# EAGLE design MicroCo (EAGLE 8.3.2)
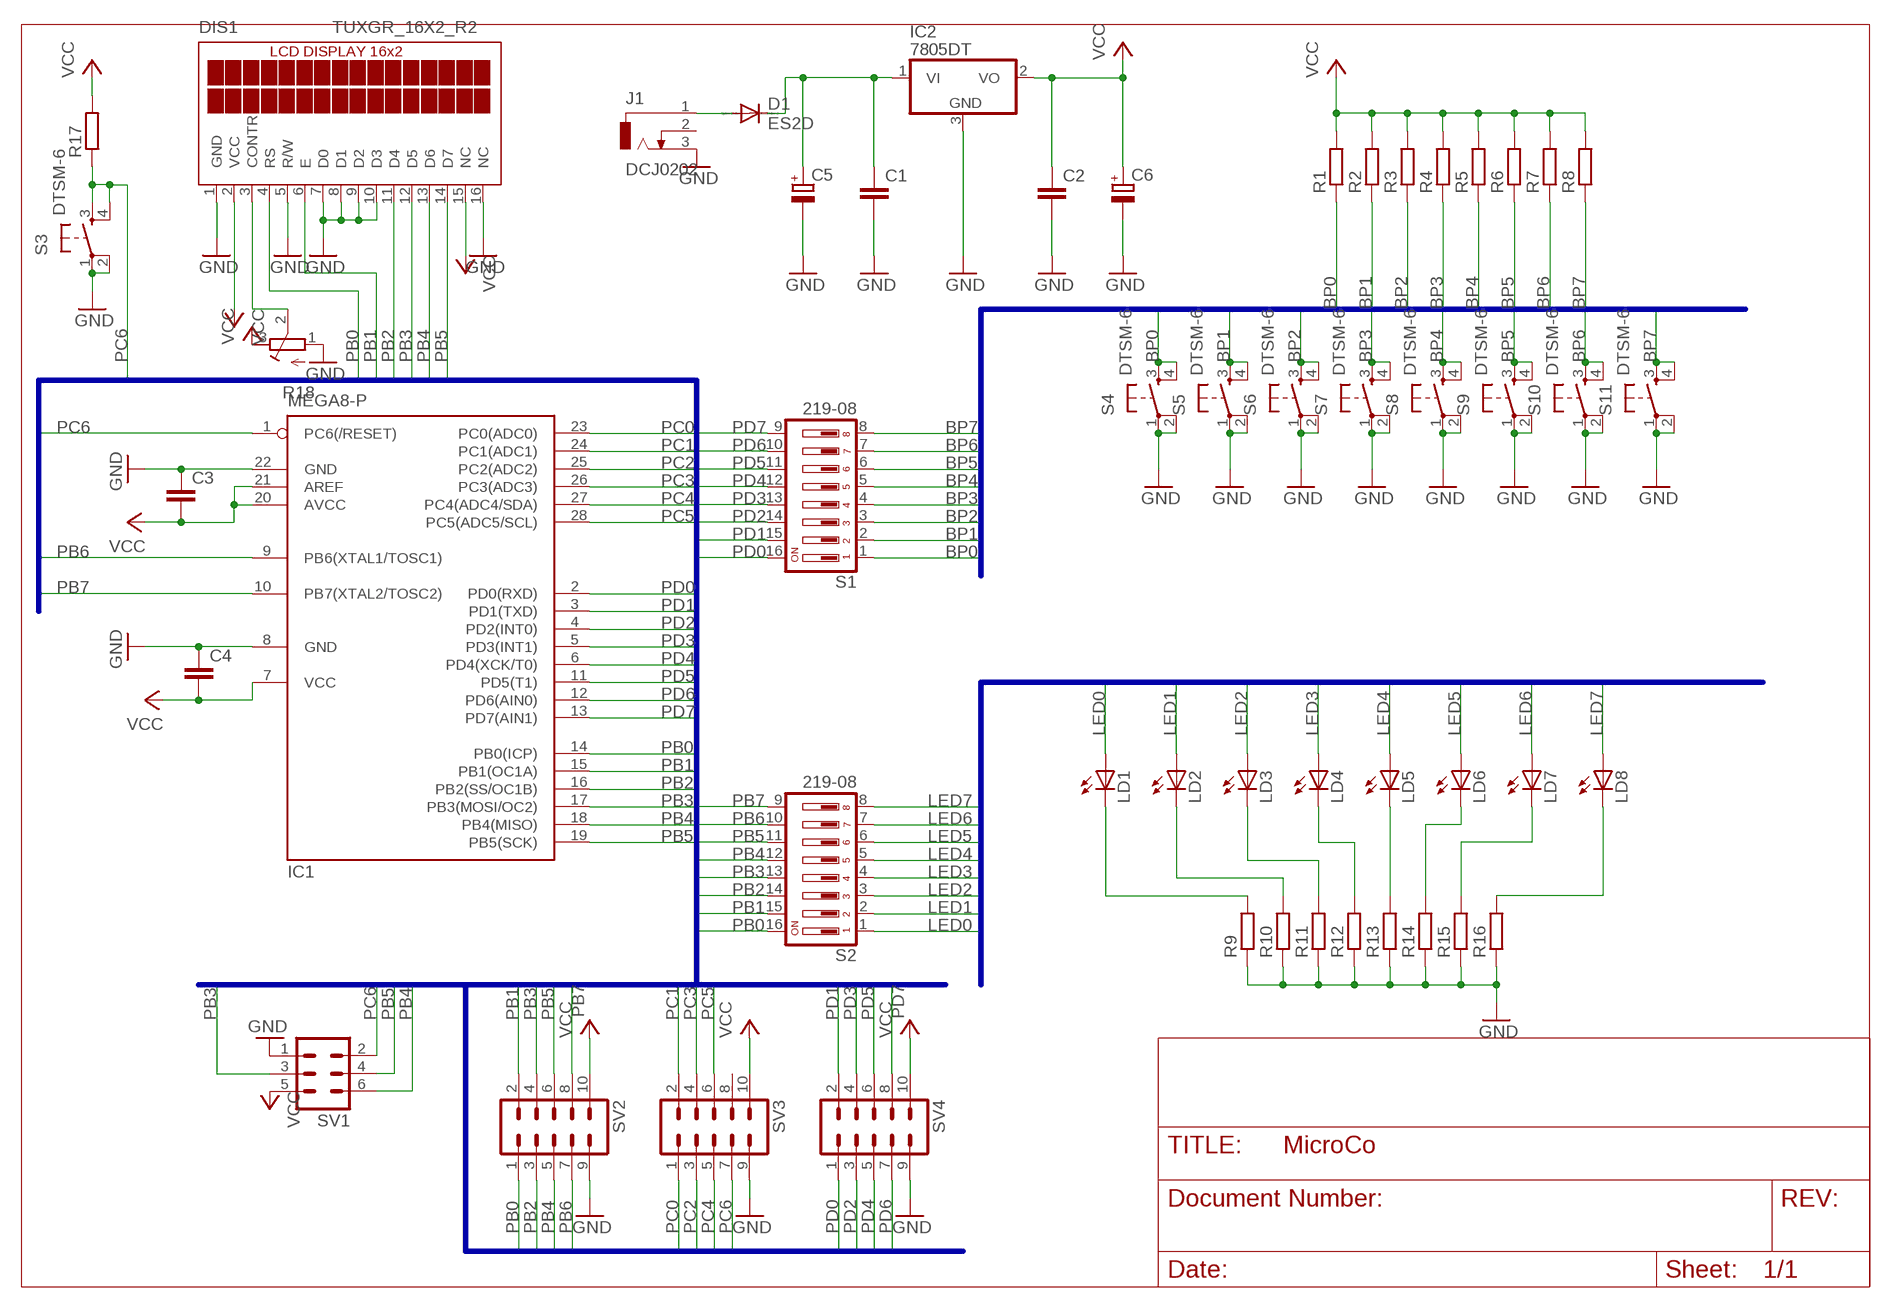
[diagram p0: schematic, sheet 1]

## Parts
C1  C-EUC1206  [C1206]
C2  C-EUC1206  [C1206]
C3  C-EUC1206  [C1206]
C4  C-EUC1206  [C1206]
C5  CPOL-EU153CLV-1010  [153CLV-1010]
C6  CPOL-EU153CLV-0605  [153CLV-0605]
D1  ES2D  [SMB]
DIS1  TUXGR_16X2_R2  [TUXGR_16X2_R2]
IC1  MEGA8-P  [DIL28-3]
IC2  7805DT  [TO252]
J1  DCJ0202  [DCJ0202]
LD1  LEDCHIPLED_1206  [CHIPLED_1206]
LD2  LEDCHIPLED_1206  [CHIPLED_1206]
LD3  LEDCHIPLED_1206  [CHIPLED_1206]
LD4  LEDCHIPLED_1206  [CHIPLED_1206]
LD5  LEDCHIPLED_1206  [CHIPLED_1206]
LD6  LEDCHIPLED_1206  [CHIPLED_1206]
LD7  LEDCHIPLED_1206  [CHIPLED_1206]
LD8  LEDCHIPLED_1206  [CHIPLED_1206]
R1  R-EU_M1206  [M1206]
R2  R-EU_M1206  [M1206]
R3  R-EU_M1206  [M1206]
R4  R-EU_M1206  [M1206]
R5  R-EU_M1206  [M1206]
R6  R-EU_M1206  [M1206]
R7  R-EU_M1206  [M1206]
R8  R-EU_M1206  [M1206]
R9  R-EU_M1206  [M1206]
R10  R-EU_M1206  [M1206]
R11  R-EU_M1206  [M1206]
R12  R-EU_M1206  [M1206]
R13  R-EU_M1206  [M1206]
R14  R-EU_M1206  [M1206]
R15  R-EU_M1206  [M1206]
R16  R-EU_M1206  [M1206]
R17  R-EU_M1206  [M1206]
R18  R-TRIMM4G/J  [RTRIM4G/J]
S1  219-08  [CTS-219-08]
S2  219-08  [CTS-219-08]
S3  DTSM-6  [DTSM-6]
S4  DTSM-6  [DTSM-6]
S5  DTSM-6  [DTSM-6]
S6  DTSM-6  [DTSM-6]
S7  DTSM-6  [DTSM-6]
S8  DTSM-6  [DTSM-6]
S9  DTSM-6  [DTSM-6]
S10  DTSM-6  [DTSM-6]
S11  DTSM-6  [DTSM-6]
SV1  ML6  [ML6]
SV2  MA05-2  [MA05-2]
SV3  MA05-2  [MA05-2]
SV4  MA05-2  [MA05-2]

## Nets
BP0: R1.1 S1.1 S4.3 S4.4
BP1: R2.1 S1.2 S5.3 S5.4
BP2: R3.1 S1.3 S6.3 S6.4
BP3: R4.1 S1.4 S7.3 S7.4
BP4: R5.1 S1.5 S8.3 S8.4
BP5: R6.1 S1.6 S9.3 S9.4
BP6: R7.1 S1.7 S10.3 S10.4
BP7: R8.1 S1.8 S11.3 S11.4
GND: C1.2 C2.2 C3.1 C4.1 C5.- C6.- DIS1.1(GND) DIS1.5(R/W) DIS1.7(D0) DIS1.8(D1) DIS1.9(D2) DIS1.10(D3) DIS1.16(NC) IC1.8(GND) IC1.22(GND) IC2.3(GND) J1.3 R9.1 R10.1 R11.1 R12.1 R13.1 R14.1 R15.1 R16.1 R18.1(A) S3.1 S3.2 S4.1 S4.2 S5.1 S5.2 S6.1 S6.2 S7.1 S7.2 S8.1 S8.2 S9.1 S9.2 S10.1 S10.2 S11.1 S11.2 SV1.1 SV2.9 SV3.9 SV4.9
LED0: LD1.A S2.1
LED1: LD2.A S2.2
LED2: LD3.A S2.3
LED3: LD4.A S2.4
LED4: LD5.A S2.5
LED5: LD6.A S2.6
LED6: LD7.A S2.7
LED7: LD8.A S2.8
N$1: DIS1.3(CONTR) R18.2(S)
N$2: D1.A J1.1
N$3: C1.1 C5.+ D1.C IC2.1(VI)
N$4: LD1.C R9.2
N$5: LD2.C R10.2
N$6: LD3.C R11.2
N$7: LD4.C R12.2
N$8: LD5.C R13.2
N$9: LD6.C R14.2
N$10: LD7.C R15.2
N$11: LD8.C R16.2
PB0: DIS1.4(RS) IC1.14(PB0(ICP)) S2.16 SV2.1
PB1: DIS1.6(E) IC1.15(PB1(OC1A)) S2.15 SV2.2
PB2: DIS1.11(D4) IC1.16(PB2(SS/OC1B)) S2.14 SV2.3
PB3: DIS1.12(D5) IC1.17(PB3(MOSI/OC2)) S2.13 SV1.3 SV2.4
PB4: DIS1.13(D6) IC1.18(PB4(MISO)) S2.12 SV1.6 SV2.5
PB5: DIS1.14(D7) IC1.19(PB5(SCK)) S2.11 SV1.4 SV2.6
PB6: IC1.9(PB6(XTAL1/TOSC1)) S2.10 SV2.7
PB7: IC1.10(PB7(XTAL2/TOSC2)) S2.9 SV2.8
PC0: IC1.23(PC0(ADC0)) SV3.1
PC1: IC1.24(PC1(ADC1)) SV3.2
PC2: IC1.25(PC2(ADC2)) SV3.3
PC3: IC1.26(PC3(ADC3)) SV3.4
PC4: IC1.27(PC4(ADC4/SDA)) SV3.5
PC5: IC1.28(PC5(ADC5/SCL)) SV3.6
PC6: IC1.1(PC6(/RESET)) R17.1 S3.3 S3.4 SV1.2 SV3.7
PD0: IC1.2(PD0(RXD)) S1.16 SV4.1
PD1: IC1.3(PD1(TXD)) S1.15 SV4.2
PD2: IC1.4(PD2(INT0)) S1.14 SV4.3
PD3: IC1.5(PD3(INT1)) S1.13 SV4.4
PD4: IC1.6(PD4(XCK/T0)) S1.12 SV4.5
PD5: IC1.11(PD5(T1)) S1.11 SV4.6
PD6: IC1.12(PD6(AIN0)) S1.10 SV4.7
PD7: IC1.13(PD7(AIN1)) S1.9 SV4.8
VCC: C2.1 C3.2 C4.2 C6.+ DIS1.2(VCC) DIS1.15(NC) IC1.7(VCC) IC1.20(AVCC) IC1.21(AREF) IC2.2(VO) R1.2 R2.2 R3.2 R4.2 R5.2 R6.2 R7.2 R8.2 R17.2 R18.3(E) SV1.5 SV2.10 SV3.10 SV4.10
Unconnected: J1.2 SV3.8

## Buses
PB[0..7],PC[0..7],PD[0..7]
BP[0..7]
LED[0..7]

## Library data of the parts
C1-C4 = rcl:C-EU: CAPACITOR, European symbol
C5 C6 = rcl:CPOL-EU: POLARIZED CAPACITOR, European symbol
D1 = diode:ES2D: DIODE super fast rectifier, 2 A
DIS1 = display-lcd:TUXGR_16X2_R2: Tuxgraphics LCD display 16x2 characters reflective, without background light Source: tuxgr_12x2_r2.pdf; OC_FARNELL: unknown; OC_NEWARK: unknown
IC1 = atmel:MEGA8-P: MICROCONTROLLER 8 Kbytes FLASH, 1 kbytes SRAM, 512 bytes EEPROM, USART, 4-channel 10 bit ADC, 2-channel 8 bit ADC Pin compatible with Atmega48, ATMega88, ATMega168 Source: avr.lbr; OC_FARNELL: unknown; OC_NEWARK: unknown
IC2 = linear:78*: Positive VOLTAGE REGULATOR Source: http://cache.national.com/ds/LM/LM78L05.pdf http://www.fairchildsemi.com/ds/LM/LM7805.pdf
J1 = con-jack:DCJ0202: DC POWER JACK Source: DCJ0202.pdf; OC_FARNELL: unknown; OC_NEWARK: unknown
LD1-LD8 = led:LED: LED OSRAM: - CHIPLED LG R971, LG N971, LY N971, LG Q971, LY Q971, LO R971, LY R971 LH N974, LH R974 LS Q976, LO Q976, LY Q976 LO Q996 - Hyper CHIPLED LW Q18S LB Q993, LB Q99A, LB R99A - SideLED LS A670, LO A670, LY A670, LG A670, LP A670 LB A673, LV A673, LT A673, LW A673 LH A674 LY A675 LS A676, LA A676, LO A676, LY A676, LW A676 LS A679, LY A679, LG A679 - Hyper Micro SIDELED® LS Y876, LA Y876, LO Y876, LY Y876 LT Y87S - SmartLED LW L88C, LW L88S LB L89C, LB L89S, LG L890 LS L89K, LO L89K, LY L89K LS L896, LA L896, LO L896, LY L896 - TOPLED LS T670, LO T670, LY T670, LG T670, LP T670 LSG T670, LSP T670, LSY T670, LOP T670, LYG T670 LG T671, LOG T671, LSG T671 LB T673, LV T673, LT T673, LW T673 LH T674 LS T676, LA T676, LO T676, LY T676, LB T676, LH T676, LSB T676, LW T676 LB T67C, LV T67C, LT T67C, LS T67K, LO T67K, LY T67K, LW E67C LS E67B, LA E67B, LO E67B, LY E67B, LB E67C, LV E67C, LT E67C LW T67C LS T679, LY T679, LG T679 LS T770, LO T770, LY T770, LG T770, LP T770 LB T773, LV T773, LT T773, LW T773 LH T774 LS E675, LA E675, LY E675, LS T675 LS T776, LA T776, LO T776, LY T776, LB T776 LHGB T686 LT T68C, LB T68C - Hyper Mini TOPLED® LB M676 - Mini TOPLED Santana® LG M470 LS M47K, LO M47K, LY M47K Source: http://www.osram.convergy.de/
R1-R17 = rcl:R-EU_: RESISTOR, European symbol
R18 = rcl:R-TRIMM: Trimm resistor
S1 S2 = switch-dil:219-08*: Surface Mount DIP Switch Series 219 SMT CTS Electronic Components Sourc: www.ctscorp.com; OC_FARNELL: unknown; OC_NEWARK: unknown
S3-S11 = switch-tact:DTSM-6
SV1 = con-ml:ML6: HARTING; OC_FARNELL: unknown; OC_NEWARK: unknown
SV2-SV4 = con-lstb:MA05-2: PIN HEADER; OC_FARNELL: unknown; OC_NEWARK: unknown

## Board
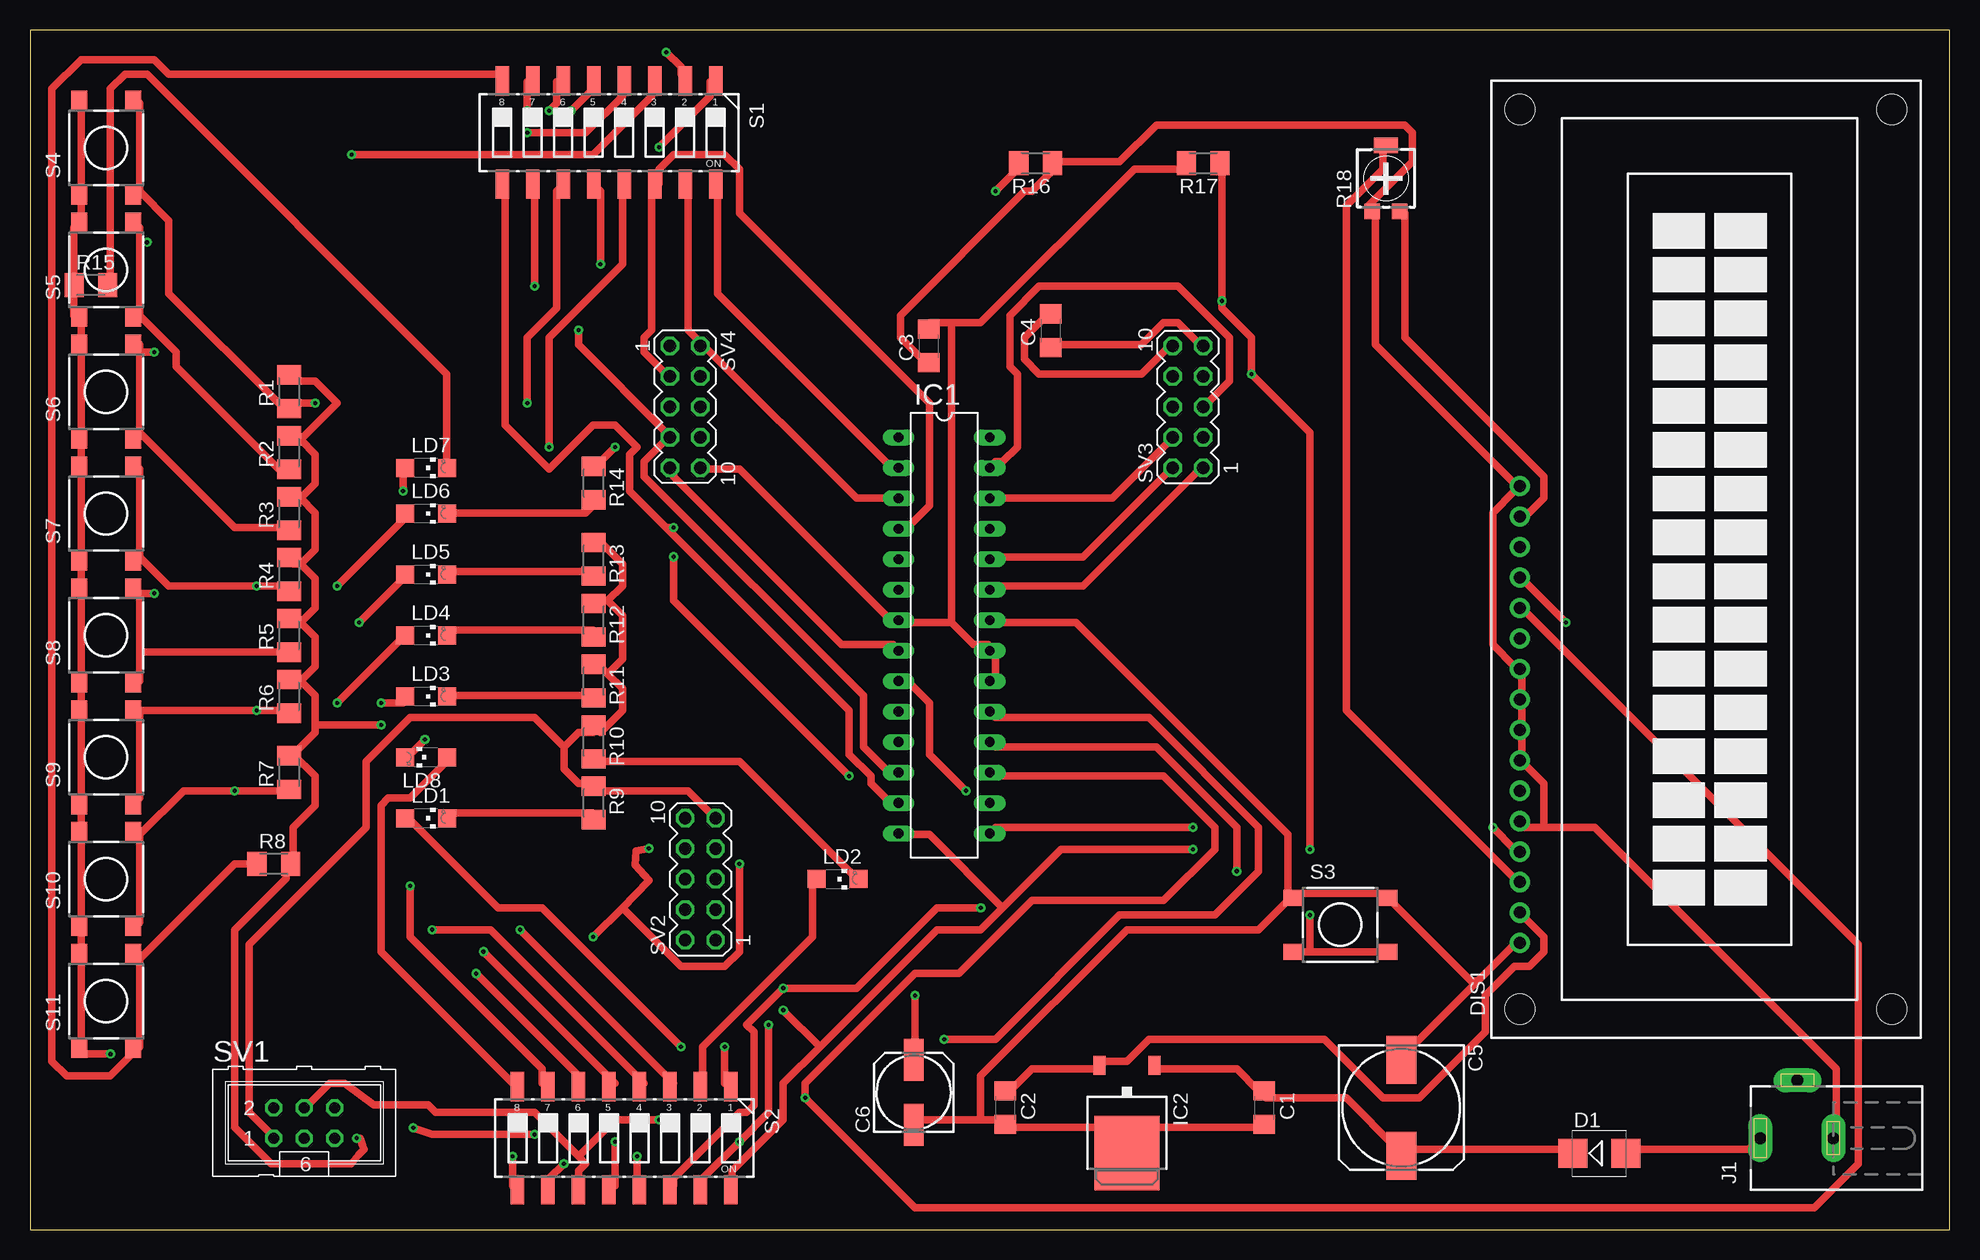
[diagram p1: board, top side]
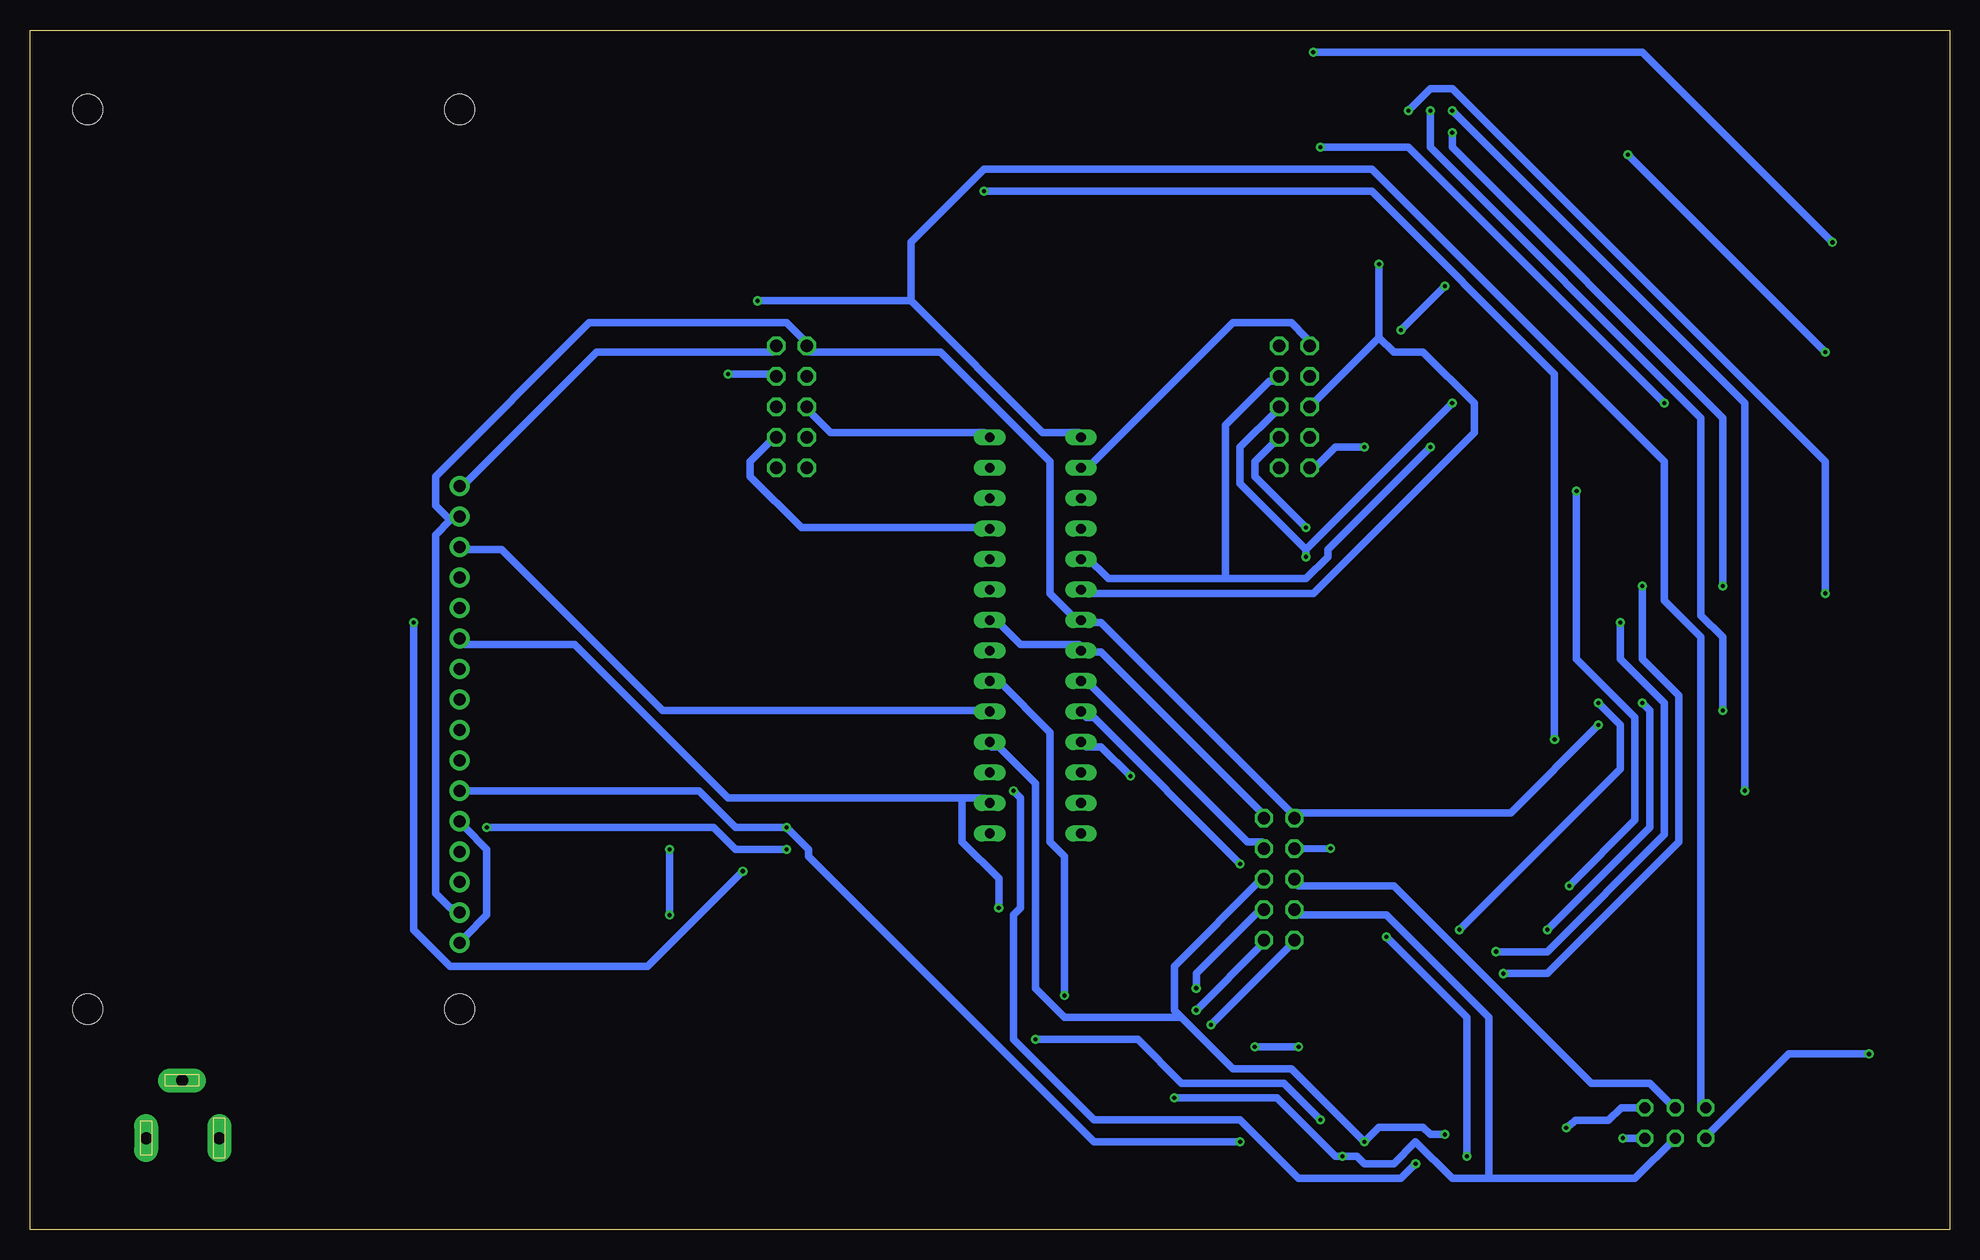
[diagram p2: board, bottom side, seen from below]

Size 160 x 100 mm. Coordinates in mm from the lower left corner, seen from the top.
Outline: 0,0 160,0 160,100 0,100 0,0
Copper layers (1*16): Top 0.035mm / dielectric 1.5mm / Bottom 0.035mm
Design rules "default *": minimum track width 24mil, minimum drill 0.35mm, track to track 24mil, track to pad 24mil, pad to pad 24mil, via to via 24mil, smd to smd 24mil, copper to edge 40mil, drill to drill 6mil, minimum pad ring 10mil, minimum via ring 8mil, stop-mask expansion 4mil, vias tented up to drill 0mil, thermal gap 10mil

### Footprints (pad centres in the part's own frame; a part is rotated, then mirrored left to right if it is on the bottom)
C1206 = smd 1.6 x 1.8: 1 -1.4,0; 2 1.4,0
153CLV-1010 = smd 4 x 2.5: + 4,0; - -4,0
153CLV-0605 = smd 3.5 x 1.6: + 2.7,0; - -2.7,0
SMB = smd 2.4 x 2.4: A 2.2,0; C -2.2,0
TUXGR_16X2_R2 = drill 1 pad 1.676: 1 -32,15.5; 2 -29.46,15.5; 3 -26.92,15.5; 4 -24.38,15.5; 5 -21.84,15.5; 6 -19.3,15.5; 7 -16.76,15.5; 8 -14.22,15.5; 9 -11.68,15.5; 10 -9.14,15.5; 11 -6.6,15.5; 12 -4.06,15.5; 13 -1.52,15.5; 14 1.02,15.5; 15 3.56,15.5; 16 6.1,15.5 | hole 2.5: -37.5,-15.5; 37.5,-15.5; -37.5,15.5; 37.5,15.5
DIL28-3 = drill 0.813 long: 1 -16.51,-3.81; 2 -13.97,-3.81; 3 -11.43,-3.81; 4 -8.89,-3.81; 5 -6.35,-3.81; 6 -3.81,-3.81; 7 -1.27,-3.81; 8 1.27,-3.81; 9 3.81,-3.81; 10 6.35,-3.81; 11 8.89,-3.81; 12 11.43,-3.81; 13 13.97,-3.81; 14 16.51,-3.81; 15 16.51,3.81; 16 13.97,3.81; 17 11.43,3.81; 18 8.89,3.81; 19 6.35,3.81; 20 3.81,3.81; 21 1.27,3.81; 22 -1.27,3.81; 23 -3.81,3.81; 24 -6.35,3.81; 25 -8.89,3.81; 26 -11.43,3.81; 27 -13.97,3.81; 28 -16.51,3.81
TO252 = smd 1 x 1.6: 1 -2.28,-4.8; 2 2.28,-4.8 | smd 5.4 x 6.2: 3 0,2.5
DCJ0202 = drill 1 pad 2 long: 1 0,3.1; 2 4.8,0; 3 0,-3
CHIPLED_1206 = smd 1.5 x 1.5: A 0,-1.75; C 0,1.75
M1206 = smd 1.6 x 2: 1 -1.4,0; 2 1.4,0
RTRIM4G/J = smd 1.3 x 1.3: 1 -1.15,-2.75; 3 1.15,-2.75 | smd 2 x 1.3: 2 0,2.75
CTS-219-08 = smd 1.13 x 2.44: 1 -8.89,-4.3; 2 -6.35,-4.3; 3 -3.81,-4.3; 4 -1.27,-4.3; 5 1.27,-4.3; 6 3.81,-4.3; 7 6.35,-4.3; 8 8.89,-4.3; 9 8.89,4.3; 10 6.35,4.3; 11 3.81,4.3; 12 1.27,4.3; 13 -1.27,4.3; 14 -3.81,4.3; 15 -6.35,4.3; 16 -8.89,4.3
DTSM-6 = smd 1.55 x 1.3: 1 -3.975,2.25; 2 3.975,2.25; 3 -3.975,-2.25; 4 3.975,-2.25
ML6 = drill 0.914 octagon: 1 -2.54,-1.27; 2 -2.54,1.27; 3 0,-1.27; 4 0,1.27; 5 2.54,-1.27; 6 2.54,1.27
MA05-2 = drill 1.016 octagon: 1 -5.08,-1.27; 2 -5.08,1.27; 3 -2.54,-1.27; 4 -2.54,1.27; 5 0,-1.27; 6 0,1.27; 7 2.54,-1.27; 8 2.54,1.27; 9 5.08,-1.27; 10 5.08,1.27

### Placement (x,y rotation side)
C1  102.87,10.16 270 top
C2  81.28,10.16 270 top
C3  74.93,73.66 90 top
C4  85.09,74.93 90 top
C5  114.3,10.16 270 top
C6  73.66,11.43 90 top
D1  130.81,6.35 0 top
DIS1  139.7,55.88 90 top
IC1  76.2,49.53 270 top
IC2  91.44,8.89 180 top
J1  147.32,7.62 90 top
LD1  33.02,34.29 270 top
LD2  67.31,29.21 270 top
LD3  33.02,44.45 270 top
LD4  33.02,49.53 270 top
LD5  33.02,54.61 270 top
LD6  33.02,59.69 270 top
LD7  33.02,63.5 270 top
LD8  33.02,39.37 90 top
R1  21.59,69.85 90 top
R2  21.59,64.77 90 top
R3  21.59,59.69 90 top
R4  21.59,54.61 90 top
R5  21.59,49.53 90 top
R6  21.59,44.45 90 top
R7  21.59,38.1 90 top
R8  20.32,30.48 0 top
R9  46.99,35.56 270 top
R10  46.99,40.64 270 top
R11  46.99,45.72 270 top
R12  46.99,50.8 270 top
R13  46.99,55.88 270 top
R14  46.99,62.23 270 top
R15  5.08,78.74 0 top
R16  83.82,88.9 180 top
R17  97.79,88.9 180 top
R18  113.03,87.63 0 top
S1  48.26,91.44 180 top
S2  49.53,7.62 180 top
S3  109.22,25.4 0 top
S4  6.35,90.17 90 top
S5  6.35,80.01 90 top
S6  6.35,69.85 90 top
S7  6.35,59.69 90 top
S8  6.35,49.53 90 top
S9  6.35,39.37 90 top
S10  6.35,29.21 90 top
S11  6.35,19.05 90 top
SV1  22.86,8.89 0 top
SV2  55.88,29.21 90 top
SV3  96.52,68.58 90 top
SV4  54.61,68.58 270 top

### Tracks (layer width: path | path; a pad name or v marks a point on that pad's centre or on a via)
BP0  (via drill 0.35)
  Top 0.61: 9.14,86.56 9.14,93.88 S4.4 | 9.14,86.56 11.58,84.12 11.58,78.03 20.73,68.89 21.34,68.89 R1.1 21.95,68.89 v23.77,68.89 | 9.14,86.56 S4.3 | v52.43,90.22 56.69,94.49 56.69,95.71 S1.1
  Bottom 0.61: v52.43,90.22 45.11,90.22 v23.77,68.89
BP1  (via drill 0.35)
  Top 0.61: 9.14,82.3 9.14,83.52 S5.4 | 9.14,82.3 9.14,76.2 | 9.14,76.2 12.19,73.15 12.19,71.93 20.73,63.4 21.34,63.4 R2.1 | 9.14,76.2 S5.3 | v53.03,98.15 54.25,96.93 54.25,96.32 S1.2 | 9.14,82.3 v9.75,82.3
  Bottom 0.61: v53.03,98.15 25.6,98.15 v9.75,82.3
BP2  (via drill 0.35)
  Top 0.61: 9.14,73.15 9.14,73.76 S6.4 9.14,73.15 | 9.14,73.15 9.14,66.45 | 9.14,66.45 17.07,58.52 21.34,58.52 R3.1 | 9.14,66.45 S6.3 | v26.82,89.61 46.94,89.61 51.82,94.49 51.82,95.71 S1.3 | 9.14,73.15 v10.36,73.15
  Bottom 0.61: v10.36,73.15 v26.82,89.61
BP3  (via drill 0.35)
  Top 0.61: 9.14,56.08 9.14,63.4 S7.4 | 9.14,56.08 11.58,53.65 v18.9,53.65 21.34,53.65 R4.1 | 9.14,56.08 S7.3 | v41.45,91.44 46.33,91.44 49.38,94.49 49.38,95.71 S1.4
  Bottom 0.61: v41.45,91.44 41.45,90.22 18.9,67.67 v18.9,53.65
BP4  (via drill 0.35)
  Top 0.61: 9.14,53.03 9.14,48.16 | 9.14,48.16 9.14,45.72 S8.3 | 9.14,48.16 21.34,48.16 R5.1 | v45.11,93.27 46.94,95.1 46.94,95.71 S1.5 | 9.14,53.03 v10.36,53.03 | 9.14,53.03 S8.4
  Bottom 0.61: v45.11,93.27 43.28,95.1 41.45,95.1 10.36,64.01 v10.36,53.03
BP5  (via drill 0.35)
  Top 0.61: 9.14,43.28 9.14,35.97 S9.3 | 9.14,43.28 v18.9,43.28 21.34,43.28 R6.1 | 9.14,43.28 S9.4 | v43.28,93.27 43.89,93.88 43.89,95.71 S1.6
  Bottom 0.61: v43.28,93.27 43.28,90.22 20.73,67.67 20.73,51.21 18.9,49.38 v18.9,43.28
BP6  (via drill 0.35)
  Top 0.61: 9.14,32.92 9.14,25.6 S10.3 | 9.14,32.92 12.8,36.58 v17.07,36.58 21.34,36.58 R7.1 | 9.14,32.92 S10.4 | v41.45,93.27 41.45,95.71 S1.7
  Bottom 0.61: v41.45,93.27 17.07,68.89 v17.07,36.58
BP7
  Top 0.61: 9.14,22.55 9.14,15.24 S11.3 8.53,14.63 6.71,12.8 3.05,12.8 1.83,14.02 1.83,95.1 4.27,97.54 10.36,97.54 11.58,96.32 39.01,96.32 S1.8 | R8.1 17.07,30.48 9.14,22.55 | 9.14,22.55 S11.4
GND  (via drill 0.35)
  Top 0.61: S4.2 4.27,93.88 4.27,86.56 S4.1 4.27,85.95 4.27,84.12 S5.2 3.66,83.52 3.66,79.25 R15.1 3.66,78.64 3.66,76.2 S5.1 4.27,75.59 4.27,74.37 S6.2 4.27,73.76 4.27,66.45 S6.1 4.27,65.84 4.27,64.01 S7.2 4.27,63.4 4.27,56.08 S7.1 4.27,55.47 4.27,53.65 S8.2 4.27,53.03 4.27,45.72 S8.1 4.27,45.11 4.27,43.89 S9.2 4.27,43.28 4.27,35.97 S9.1 4.27,35.36 4.27,33.53 S10.2 4.27,32.92 4.27,25.6 S10.1 4.27,24.99 4.27,23.16 S11.2 4.27,22.55 4.27,15.24 S11.1 4.27,14.63 v6.71,14.63 | v48.77,65.23 47.55,64.01 R14.1 | SV4.9 53.65,63.4 53.65,62.79 67.67,48.77 71.93,48.77 IC1.8 | 48.16,52.43 47.55,52.43 R12.1 | 48.16,52.43 49.38,53.65 49.38,55.47 47.55,57.3 R13.1 | 44.5,40.23 44.5,38.41 45.72,37.19 46.94,37.19 R9.1 47.55,36.58 54.86,36.58 SV2.9 | 44.5,40.23 45.72,41.45 46.94,41.45 R10.1 47.55,41.45 49.38,43.28 49.38,45.11 48.16,46.33 | 48.16,46.33 47.55,46.94 R11.1 | 44.5,40.23 42.06,42.67 31.7,42.67 28.04,39.01 28.04,33.53 18.29,23.77 18.29,9.75 20.12,7.92 SV1.1 | 48.16,52.43 49.38,51.21 49.38,47.55 48.16,46.33 | C3.1 74.37,72.54 72.54,74.37 72.54,76.2 82.91,86.56 83.52,86.56 85.34,88.39 R16.1 85.34,89 90.83,89 93.88,92.05 114.61,92.05 115.21,91.44 115.21,89 111.56,85.34 R18.1 112.17,84.73 112.17,73.76 123.75,62.18 DIS1.16 123.75,61.57 121.92,59.74 121.92,48.77 123.75,46.94 DIS1.10 124.36,46.33 124.36,44.5 DIS1.9 124.36,43.89 124.36,42.06 DIS1.8 124.36,41.45 124.36,39.62 DIS1.7 124.36,39.01 126.19,37.19 126.19,33.53 | C4.1 85.34,73.76 92.66,73.76 94.49,75.59 95.71,75.59 97.54,73.76 SV3.9 | 79.25,9.14 73.76,9.14 C6.- | 79.25,9.14 81.08,9.14 C2.2 81.69,8.53 89.61,8.53 91.44,6.71
  Top 0.61: 91.44,6.71 93.27,8.53 102.41,8.53 C1.2 | 91.44,6.71 IC2.3 | S3.1 105.46,28.04 112.78,28.04 S3.2 113.39,27.43 120.09,20.73 120.7,20.73 | 120.7,20.73 123.75,23.77 DIS1.1 | 120.7,20.73 114.61,14.63 C5.- | 126.19,33.53 124.36,33.53 DIS1.5 | 126.19,33.53 130.45,33.53 150.57,13.41 150.57,7.92 J1.3 | 79.25,9.14 79.25,12.8 91.44,24.99 102.41,24.99 104.85,27.43 S3.1 | IC1.22 80.47,50.6 87.17,50.6 104.85,32.92 104.85,28.04 S3.1
  Bottom 0.61: v48.77,65.23 51.21,65.23 53.03,63.4 SV4.9 | IC1.22 79.86,51.21 77.42,48.77 72.54,48.77 IC1.8 71.93,48.16 70.71,48.16 57.3,34.75 SV2.9 | v6.71,14.63 13.41,14.63 20.12,7.92 SV1.1 | SV3.9 98.15,73.15 112.78,73.15 123.75,62.18 DIS1.16 | DIS1.1 123.75,24.38 121.92,26.21 121.92,31.7 123.75,33.53 DIS1.5
LED0  (via drill 0.35)
  Top 0.61: v54.25,15.24 42.67,26.82 39.01,26.82 31.7,34.14 LD1.A | v57.91,15.24 57.91,12.19 S2.1
  Bottom 0.61: v57.91,15.24 v54.25,15.24
LED1
  Top 0.61: LD2.A 65.23,28.65 65.23,24.38 56.08,15.24 56.08,12.19 S2.2
LED2  (via drill 0.35)
  Top 0.61: v29.26,43.89 31.09,43.89 LD3.A | v40.84,24.99 53.65,12.19 S2.3
  Bottom 0.61: v29.26,43.89 27.43,42.06 27.43,38.41 v40.84,24.99
LED3  (via drill 0.35)
  Top 0.61: v25.6,43.89 31.09,49.38 LD4.A | v33.53,24.99 38.41,24.99 51.21,12.19 S2.4
  Bottom 0.61: v25.6,43.89 24.99,43.28 24.99,33.53 v33.53,24.99
LED4  (via drill 0.35)
  Top 0.61: v27.43,50.6 31.09,54.25 LD5.A | v37.8,23.16 48.77,12.19 S2.5
  Bottom 0.61: v27.43,50.6 27.43,47.55 23.77,43.89 23.77,32.92 33.53,23.16 v37.8,23.16
LED5  (via drill 0.35)
  Top 0.61: v25.6,53.65 31.09,59.13 LD6.A | v37.19,21.34 45.72,12.8 S2.6
  Bottom 0.61: v25.6,53.65 25.6,47.55 22.55,44.5 22.55,32.31 33.53,21.34 v37.19,21.34
LED6  (via drill 0.35)
  Top 0.61: v31.09,61.57 31.09,63.4 LD7.A | v31.7,28.65 31.7,24.38 42.67,13.41 42.67,12.19 S2.7
  Bottom 0.61: v31.09,61.57 31.09,47.55 26.21,42.67 26.21,34.14 v31.7,28.65
LED7
  Top 0.61: LD8.A 34.75,39.01 31.7,35.97 29.87,35.97 29.26,35.36 29.26,23.16 40.23,12.19 S2.8
N$1
  Top 0.61: R18.2 112.78,90.22 112.78,88.39 109.73,85.34 109.73,43.28 123.75,29.26 DIS1.3
N$2
  Top 0.61: D1.A 133.5,6.71 143.26,6.71 143.87,7.32 J1.1
N$3
  Top 0.61: IC2.1 93.88,13.41 100.58,13.41 102.41,11.58 C1.1 103.02,10.97 109.73,10.97 114,6.71 C5.+ 114.61,6.71 128.02,6.71 D1.C
N$4
  Top 0.61: LD1.C 35.36,34.75 46.94,34.75 R9.2
N$5
  Top 0.61: LD2.C 68.89,29.26 59.13,39.01 47.55,39.01 R10.2
N$6
  Top 0.61: LD3.C 35.36,44.5 46.94,44.5 R11.2
N$7
  Top 0.61: LD4.C 35.36,49.99 46.94,49.99 R12.2
N$8
  Top 0.61: LD5.C 35.36,54.86 46.94,54.86 R13.2
N$9
  Top 0.61: LD6.C 35.36,59.74 46.33,59.74 46.94,60.35 R14.2
N$10
  Top 0.61: LD7.C 34.75,64.01 34.75,71.32 9.75,96.32 7.92,96.32 6.71,95.1 6.71,79.25 R15.2
N$11  (via drill 0.35)
  Top 0.61: v32.92,40.84 31.7,39.62 LD8.C | v80.47,86.56 82.3,88.39 R16.2
  Bottom 0.61: v32.92,40.84 32.92,71.32 48.16,86.56 v80.47,86.56
PB0  (via drill 0.35)
  Top 0.61: 65.84,15.24 75.59,24.99 79.25,24.99 81.08,26.82 | 65.84,15.24 62.79,12.19 62.79,9.14 58.52,4.88 58.52,3.66 S2.16 | 81.08,26.82 74.98,32.92 72.54,32.92 IC1.14 | 65.84,15.24 v62.79,18.29 | v121.92,33.53 123.75,31.7 DIS1.4 | v96.93,31.7 85.95,31.7 81.08,26.82
  Bottom 0.61: v62.79,18.29 57.3,23.77 SV2.1 | v121.92,33.53 103.02,33.53 101.19,31.7 v96.93,31.7
PB1  (via drill 0.35)
  Top 0.61: v61.57,17.07 61.57,9.75 v59.13,7.32 56.08,4.27 56.08,3.66 S2.15 | v96.93,33.53 80.47,33.53 IC1.15
  Bottom 0.61: v61.57,17.07 54.86,23.77 SV2.2 | DIS1.6 123.75,36.58 104.24,36.58 101.19,33.53 v96.93,33.53 95.1,31.7 95.1,31.09 71.32,7.32 v59.13,7.32
PB2  (via drill 0.35)
  Top 0.61: S2.14 53.65,3.66 53.65,4.27 59.13,9.75 59.74,9.75 60.35,10.36 60.35,16.46 59.74,17.07 v62.79,20.12 68.89,20.12 75.59,26.82 v79.25,26.82
  Bottom 0.61: v62.79,20.12 62.79,21.34 57.3,26.82 SV2.3 | 82.3,35.97 101.8,35.97 114.61,48.77 123.75,48.77 DIS1.11 | 82.3,35.97 80.47,35.97 IC1.16 | v79.25,26.82 79.25,29.26 82.3,32.31 82.3,35.97
PB3  (via drill 0.35)
  Top 0.61: v50.6,6.1 50.6,3.66 S2.13 | IC1.17 80.47,37.8 94.49,37.8 98.75,33.53 98.75,31.7 94.49,27.43 83.52,27.43 77.42,21.34 73.76,21.34 64.62,12.19 v64.62,10.97 73.76,1.83 148.74,1.83 152.4,5.49 152.4,23.77 124.36,51.82 DIS1.12
  Bottom 0.61: 38.41,4.27 26.21,4.27 SV1.3 | 38.41,4.27 41.45,4.27 44.5,7.32 46.33,5.49 48.77,5.49 49.38,6.1 v50.6,6.1 51.21,6.1 56.08,10.97 v64.62,10.97 | 38.41,4.27 38.41,17.68 46.94,26.21 54.25,26.21 SV2.4
PB4  (via drill 0.35)
  Top 0.61: v48.77,7.32 48.77,3.66 S2.12 | v31.95,8.48 31.9,8.48 33.53,7.92 v42.06,7.92 | v128.02,50.6 124.36,54.25 DIS1.13 | v100.58,29.87 100.58,33.53 93.88,40.23 80.47,40.23 IC1.18
  Bottom 0.61: 64.01,17.68 64.62,18.29 64.62,21.95 57.3,29.26 SV2.5 | 64.01,17.68 59.74,13.41 54.86,13.41 v48.77,7.32 47.55,8.53 43.89,8.53 43.28,7.92 v42.06,7.92 | 64.01,17.68 73.76,17.68 76.2,20.12 76.2,37.19 79.25,40.23 79.86,40.23 IC1.18 | v31.95,8.48 31.34,8.94 31.19,9.09 28.42,9.09 27.36,10.16 SV1.6 | v128.02,50.6 128.02,24.99 124.97,21.95 108.51,21.95 v100.58,29.87
PB5  (via drill 0.35)
  Top 0.61: S2.11 45.72,4.88 46.33,5.49 45.72,6.1 | 45.72,6.1 42.06,9.75 33.81,9.78 33.17,10.41 28.65,10.41 26.21,12.19 24.99,12.19 23.16,10.36 SV1.4 | 45.72,6.1 48.77,9.14 v52.43,9.14 | v76.2,15.85 80.47,15.85 90.83,26.21 98.75,26.21 102.41,29.87 102.41,33.53 93.27,42.67 80.47,42.67 IC1.19
  Bottom 0.61: SV2.6 54.25,28.65 46.33,28.65 29.87,12.19 24.99,12.19 23.16,10.36 SV1.4 | IC1.19 80.47,43.28 107.29,43.28 120.7,56.69 123.75,56.69 DIS1.14 | v52.43,9.14 55.47,12.19 64.01,12.19 67.67,15.85 v76.2,15.85
PB6  (via drill 0.35)
  Top 0.61: v44.5,5.49 43.28,4.27 43.28,3.66 S2.10 | v78.03,36.58 74.98,39.62 74.98,43.89 73.15,45.72 IC1.9
  Bottom 0.61: v44.5,5.49 45.72,4.27 54.25,4.27 59.13,9.14 71.32,9.14 78.03,15.85 78.03,26.21 77.42,26.82 77.42,35.97 v78.03,36.58 | SV2.7 57.3,32.31 58.52,32.31 71.93,45.72 IC1.9
PB7  (via drill 0.35)
  Top 0.61: v40.23,6.1 40.23,3.66 S2.9 | v51.59,31.77 50.52,31.55 50.44,30.38 51.59,29.11 51.56,29.06 49.38,26.82 | 49.38,26.82 v46.94,24.38 | v59.13,30.48 59.13,23.16 57.91,21.95 54.25,21.95 49.38,26.82
  Bottom 0.61: v40.23,6.1 40.23,17.68 v46.94,24.38 | v51.59,31.77 SV2.8 | v59.13,30.48 71.32,42.67 71.93,42.67 IC1.10
PC0
  Top 0.61: IC1.23 80.47,53.65 87.78,53.65 97.54,63.4 SV3.1
PC1
  Top 0.61: IC1.24 80.47,56.08 87.78,56.08 95.1,63.4 SV3.2
PC2
  Bottom 0.61: IC1.25 80.47,58.52 95.71,58.52 99.97,62.79 99.97,64.01 98.15,65.84 SV3.3
PC3
  Top 0.61: IC1.26 90.22,60.96 95.1,65.84 SV3.4
PC4
  Top 0.61: IC1.27 80.47,64.01 81.08,64.01 82.3,65.23 82.3,71.32 81.69,71.93 81.69,76.2 84.12,78.64 95.71,78.64 99.97,74.37 99.97,70.71 98.15,68.89 SV3.5
PC5
  Bottom 0.61: IC1.28 80.47,66.45 93.27,66.45 95.1,68.28 SV3.6
PC6  (via drill 0.35)
  Top 0.61: 106.68,23.16 112.78,23.16 S3.4 | 106.68,23.16 105.46,23.16 S3.3 | R17.1 99.36,88.39 v99.36,77.42 99.36,76.81 101.8,74.37 v101.8,71.32 106.68,66.45 v106.68,31.7 | v106.68,26.21 106.68,23.16
  Bottom 0.61: v101.8,71.32 98.15,71.32 SV3.7 | 86.56,77.42 75.59,66.45 72.54,66.45 IC1.1 | v99.36,77.42 86.56,77.42 | 86.56,77.42 86.56,82.3 80.47,88.39 48.16,88.39 23.77,64.01 23.77,52.43 20.73,49.38 20.73,10.36 SV1.2 | v106.68,31.7 v106.68,26.21
PD0
  Top 0.61: S1.16 57.3,86.56 57.3,78.03 71.93,63.4 IC1.2
  Bottom 0.61: SV4.1 53.65,73.76 53.65,74.37 54.86,75.59 59.74,75.59 71.93,63.4 IC1.2
PD1
  Top 0.61: 56.08,73.76 54.86,74.98 54.86,86.56 S1.15 | IC1.3 68.89,60.96 56.08,73.76 | 56.08,73.76 SV4.2
PD2
  Top 0.61: SV4.3 53.03,71.32 51.21,73.15 51.21,74.37 51.82,74.98 51.82,86.56 S1.14 52.43,87.17 52.43,88.39 53.65,89.61 57.91,89.61 59.13,88.39 59.13,84.73 74.98,68.89 74.98,60.35 73.15,58.52 72.54,58.52 IC1.4
PD3  (via drill 0.35)
  Top 0.61: v43.28,65.23 43.28,74.37 49.38,80.47 49.38,86.56 S1.13
  Bottom 0.61: v43.28,65.23 51.82,56.69 51.82,56.08 53.65,54.25 60.35,54.25 | 60.35,54.25 70.1,54.25 71.93,56.08 IC1.5 | 60.35,54.25 60.35,67.06 56.69,70.71 56.08,70.71 SV4.4
PD4  (via drill 0.35)
  Top 0.61: v47.55,80.47 47.55,86.56 S1.12
  Bottom 0.61: 47.55,74.37 v47.55,80.47 | SV4.5 47.55,74.37 | 47.55,74.37 46.33,73.15 43.89,73.15 39.62,68.89 39.62,66.45 53.03,53.03 71.93,53.03 IC1.6
PD5  (via drill 0.35)
  Top 0.61: v41.45,68.89 41.45,74.37 43.89,76.81 43.89,86.56 S1.11 | v68.28,37.8 53.65,52.43 v53.65,56.08
  Bottom 0.61: 53.65,56.69 v41.45,68.89 | 53.65,56.69 59.13,62.18 59.13,65.23 56.08,68.28 SV4.6 | v68.28,37.8 70.71,40.23 71.93,40.23 IC1.11 | 53.65,56.69 v53.65,56.08
PD6  (via drill 0.35)
  Top 0.61: v42.06,78.64 42.06,86.56 S1.10 | v45.72,74.98 45.72,73.76 53.03,66.45 SV4.7 53.03,65.84 51.21,64.01 51.21,62.79 69.49,44.5 69.49,40.23 71.32,38.41 71.93,38.41 IC1.12
  Bottom 0.61: v45.72,74.98 v42.06,78.64
PD7  (via drill 0.35)
  Top 0.61: 53.03,58.52 68.28,43.28 68.28,39.62 70.1,37.8 70.1,37.19 71.93,35.36 IC1.13 | 53.03,58.52 49.99,61.57 49.99,64.62 50.6,65.23 48.77,67.06 46.94,67.06 43.28,63.4 39.62,67.06 39.62,86.56 S1.9 | 53.03,58.52 v53.65,58.52
  Bottom 0.61: SV4.8 57.91,64.01 57.91,62.79 v53.65,58.52
VCC  (via drill 0.35)
  Top 0.61: C2.1 81.69,11.58 83.52,13.41 89,13.41 IC2.2 89.61,14.02 91.44,14.02 93.27,15.85 107.9,15.85 112.78,10.97 115.82,10.97 121.31,16.46 121.31,19.51 123.75,21.95 124.97,21.95 126.19,23.16 126.19,24.38 124.36,26.21 DIS1.2 | R18.3 114.61,84.73 114.61,74.37 126.19,62.79 126.19,60.96 124.36,59.13 DIS1.15 | 21.95,39.62 23.77,41.45 23.77,42.06 | 23.77,42.06 23.77,44.5 22.55,45.72 | 22.55,45.72 21.95,46.33 R6.2 22.55,45.72 | 22.55,50.6 21.95,50.6 R5.2 22.55,50.6 | 22.55,50.6 23.77,49.38 23.77,46.94 22.55,45.72 | 22.55,55.47 21.95,55.47 R4.2 22.55,55.47 | 22.55,55.47 23.77,54.25 23.77,51.82 22.55,50.6 | 22.55,60.96 21.95,60.96 R3.2 22.55,60.96 | 22.55,60.96 23.77,59.74 23.77,56.69 22.55,55.47 | 22.55,65.84 21.95,65.84 R2.2 22.55,65.84 | 22.55,65.84 23.77,64.62 23.77,62.18 22.55,60.96 | 22.55,65.84 25.6,68.89 23.77,70.71 21.95,70.71 R1.2 | 21.95,39.62 23.77,37.8 23.77,35.36 21.95,33.53 21.95,30.48 R8.2 21.34,30.48 21.34,29.26 17.07,24.99 17.07,8.53 20.12,5.49 23.16,5.49 26.72,5.46 26.77,5.49 27.41,6.25 27.84,6.71 27.74,6.99 27.51,7.59 v27.23,7.62 | 21.95,39.62 R7.2 | 76.81,75.59 79.25,75.59 92.05,88.39 96.32,88.39 R17.2 | 76.81,75.59 74.98,75.59 C3.2 | C4.2 84.73,76.2 82.91,74.37 82.91,72.54 84.12,71.32 92.66,71.32 95.1,73.76 SV3.10 | IC1.20 80.47,45.72 80.47,48.16 IC1.21 79.86,48.77 78.64,48.77 76.81,50.6 | 76.81,50.6 72.54,50.6 IC1.7 71.93,50.6 59.13,63.4 56.08,63.4 SV4.10 | v73.76,19.51 73.76,14.63 C6.+ | 76.81,50.6 76.81,75.59 | v29.26,42.06 23.77,42.06
  Bottom 0.61: 124.97,59.13 124.36,59.74 DIS1.15 124.97,59.13 | 124.97,59.13 126.19,57.91 126.19,28.04 124.97,26.82 124.36,26.82 DIS1.2 | v27.23,7.62 SV1.5 | v73.76,19.51 73.76,31.09 74.98,32.31 74.98,41.45 79.25,45.72 IC1.20 | v29.26,42.06 36.58,34.75 54.25,34.75 SV2.10 54.86,34.75 70.71,50.6 71.93,50.6 IC1.7 72.54,50.6 74.98,53.03 74.98,64.01 84.12,73.15 95.1,73.15 SV3.10 95.1,73.76 96.93,75.59 113.39,75.59 126.19,62.79 126.19,60.35 124.97,59.13